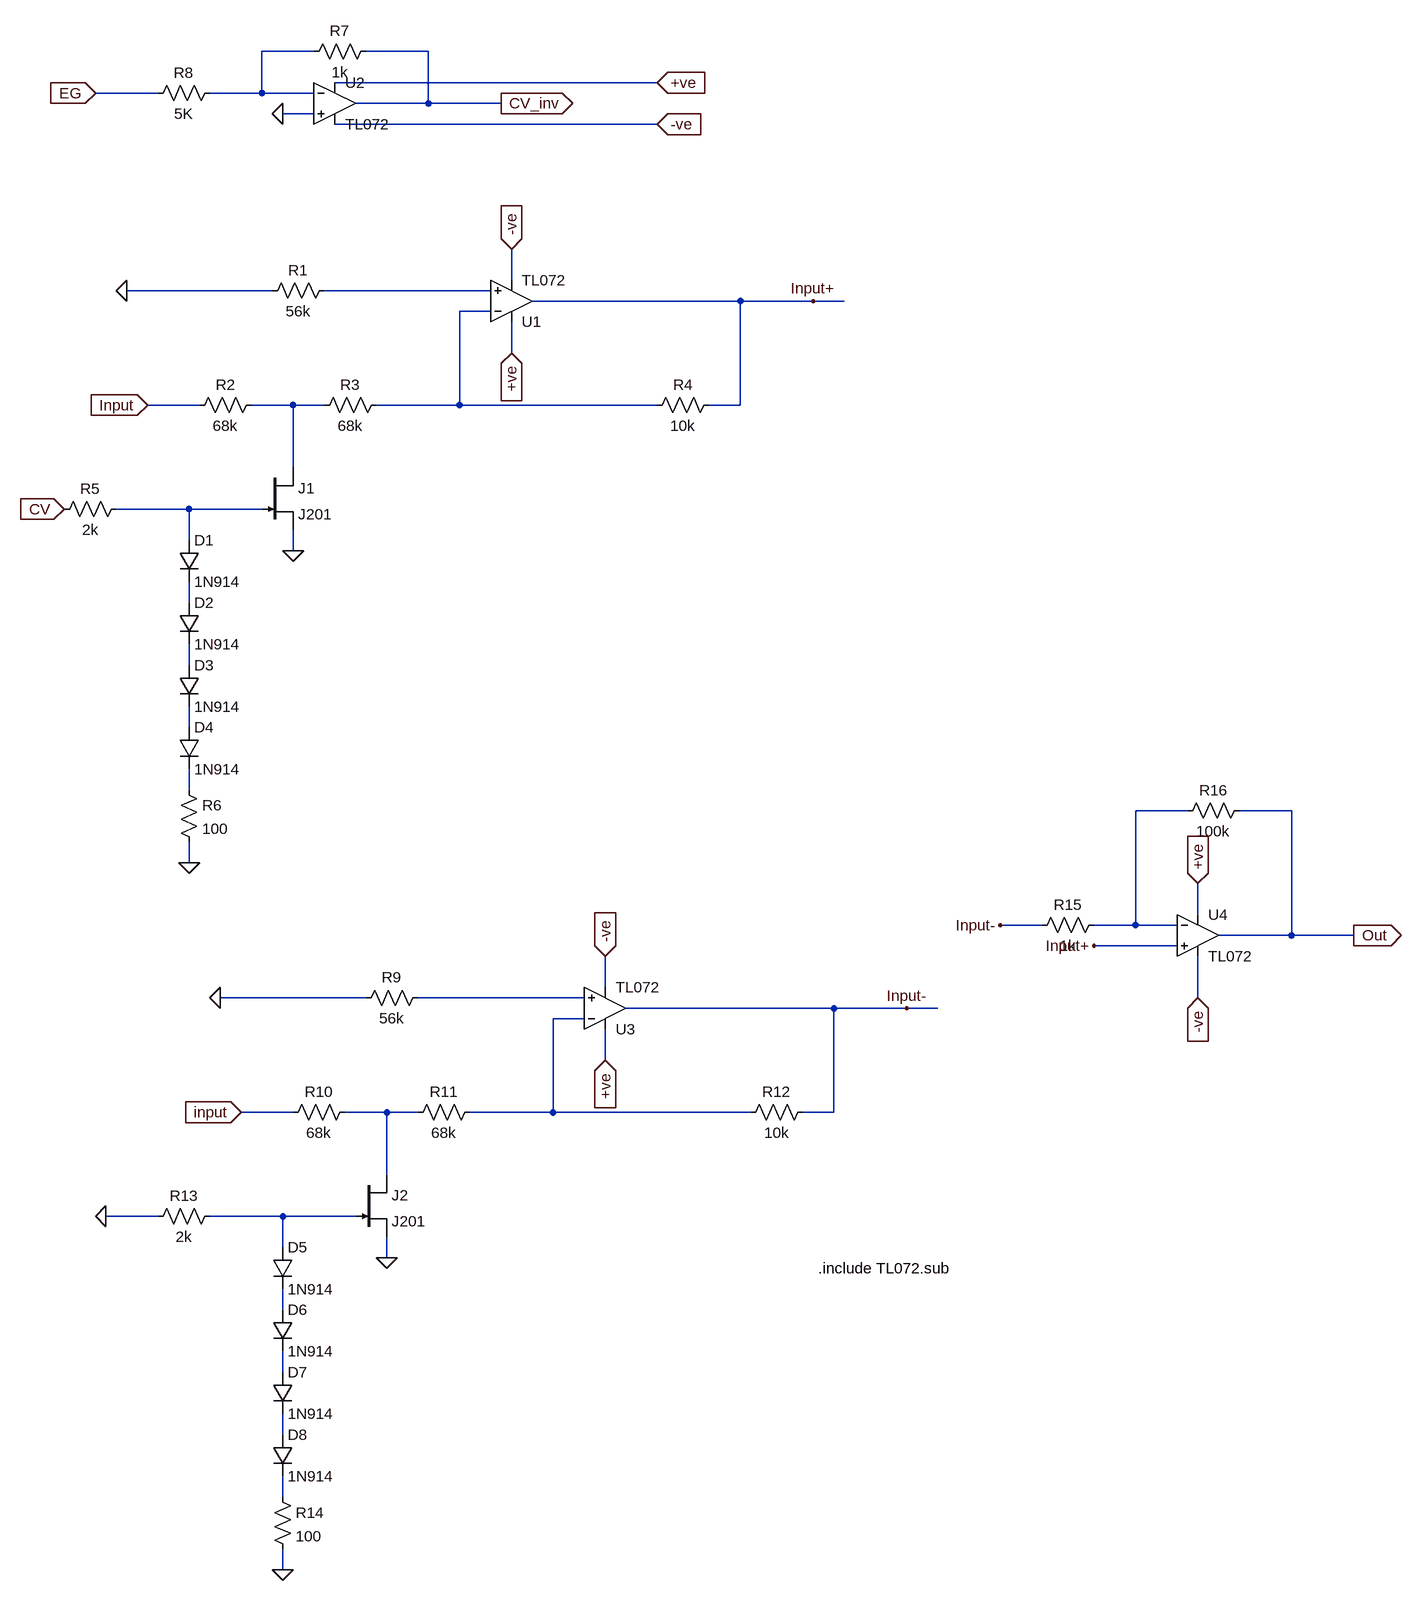
[diagram p0: schematic VCA_final.asc]
VCA_final.asc, the LTspice schematic file:
Version 4
SHEET 1 2292 680
WIRE -400 -2032 -480 -2032
WIRE -224 -2032 -320 -2032
WIRE 128 -1984 -368 -1984
WIRE -640 -1968 -736 -1968
WIRE -480 -1968 -480 -2032
WIRE -480 -1968 -560 -1968
WIRE -400 -1968 -480 -1968
WIRE -224 -1952 -224 -2032
WIRE -224 -1952 -336 -1952
WIRE -112 -1952 -224 -1952
WIRE -400 -1936 -448 -1936
WIRE 128 -1920 -368 -1920
WIRE -96 -1680 -96 -1728
WIRE -464 -1664 -688 -1664
WIRE -128 -1664 -384 -1664
WIRE 256 -1648 -64 -1648
WIRE 368 -1648 256 -1648
WIRE 416 -1648 368 -1648
WIRE -128 -1632 -176 -1632
WIRE -96 -1568 -96 -1616
WIRE -576 -1488 -656 -1488
WIRE -432 -1488 -496 -1488
WIRE -384 -1488 -432 -1488
WIRE -176 -1488 -176 -1632
WIRE -176 -1488 -304 -1488
WIRE 128 -1488 -176 -1488
WIRE 256 -1488 256 -1648
WIRE 256 -1488 208 -1488
WIRE -432 -1392 -432 -1488
WIRE -592 -1328 -704 -1328
WIRE -480 -1328 -592 -1328
WIRE -592 -1280 -592 -1328
WIRE -432 -1264 -432 -1296
WIRE -592 -1184 -592 -1216
WIRE -592 -1088 -592 -1120
WIRE -592 -992 -592 -1024
WIRE -592 -896 -592 -928
WIRE 944 -864 864 -864
WIRE 1104 -864 1024 -864
WIRE -592 -784 -592 -816
WIRE 960 -704 960 -752
WIRE 720 -688 656 -688
WIRE 864 -688 864 -864
WIRE 864 -688 800 -688
WIRE 928 -688 864 -688
WIRE 1104 -672 1104 -864
WIRE 1104 -672 992 -672
WIRE 1200 -672 1104 -672
WIRE 928 -656 800 -656
WIRE 48 -592 48 -640
WIRE -320 -576 -544 -576
WIRE 16 -576 -240 -576
WIRE 960 -576 960 -640
WIRE 400 -560 80 -560
WIRE 512 -560 400 -560
WIRE 560 -560 512 -560
WIRE 16 -544 -32 -544
WIRE 48 -480 48 -528
WIRE -432 -400 -512 -400
WIRE -288 -400 -352 -400
WIRE -240 -400 -288 -400
WIRE -32 -400 -32 -544
WIRE -32 -400 -160 -400
WIRE 272 -400 -32 -400
WIRE 400 -400 400 -560
WIRE 400 -400 352 -400
WIRE -288 -304 -288 -400
WIRE -640 -240 -720 -240
WIRE -448 -240 -560 -240
WIRE -336 -240 -448 -240
WIRE -448 -192 -448 -240
WIRE -288 -176 -288 -208
WIRE -448 -96 -448 -128
WIRE -448 0 -448 -32
WIRE -448 96 -448 64
WIRE -448 192 -448 160
WIRE -448 304 -448 272
FLAG -688 -1664 0
FLAG -432 -1264 0
FLAG -592 -784 0
FLAG -656 -1488 Input
IOPIN -656 -1488 In
FLAG -96 -1728 -ve
IOPIN -96 -1728 In
FLAG -96 -1568 +ve
IOPIN -96 -1568 In
FLAG -448 -1936 0
FLAG 128 -1984 +ve
IOPIN 128 -1984 In
FLAG 128 -1920 -ve
IOPIN 128 -1920 In
FLAG 368 -1648 Input+
FLAG -736 -1968 EG
IOPIN -736 -1968 In
FLAG -112 -1952 CV_inv
IOPIN -112 -1952 Out
FLAG -544 -576 0
FLAG -288 -176 0
FLAG -448 304 0
FLAG 48 -640 -ve
IOPIN 48 -640 In
FLAG 48 -480 +ve
IOPIN 48 -480 In
FLAG 512 -560 Input-
FLAG -720 -240 0
FLAG 960 -752 +ve
IOPIN 960 -752 In
FLAG 960 -576 -ve
IOPIN 960 -576 In
FLAG 800 -656 Input+
FLAG 656 -688 Input-
FLAG 1200 -672 Out
IOPIN 1200 -672 Out
FLAG -784 -1328 CV
IOPIN -784 -1328 In
FLAG -512 -400 input
IOPIN -512 -400 In
DATAFLAG -592 -1312 ""
DATAFLAG -448 -224 ""
SYMBOL res -368 -1680 R90
WINDOW 0 0 56 VBottom 2
WINDOW 3 32 56 VTop 2
SYMATTR InstName R1
SYMATTR Value 56k
SYMBOL res -480 -1504 R90
WINDOW 0 0 56 VBottom 2
WINDOW 3 32 56 VTop 2
SYMATTR InstName R2
SYMATTR Value 68k
SYMBOL res -288 -1504 R90
WINDOW 0 0 56 VBottom 2
WINDOW 3 32 56 VTop 2
SYMATTR InstName R3
SYMATTR Value 68k
SYMBOL res 224 -1504 R90
WINDOW 0 0 56 VBottom 2
WINDOW 3 32 56 VTop 2
SYMATTR InstName R4
SYMATTR Value 10k
SYMBOL res -688 -1344 R90
WINDOW 0 0 56 VBottom 2
WINDOW 3 32 56 VTop 2
SYMATTR InstName R5
SYMATTR Value 2k
SYMBOL Opamps\\opamp2 -96 -1584 M180
SYMATTR InstName U1
SYMATTR Value TL072
SYMBOL njf -480 -1392 R0
SYMATTR InstName J1
SYMATTR Value J201
SYMBOL diode -608 -1280 R0
SYMATTR InstName D1
SYMATTR Value 1N914
SYMBOL diode -608 -1184 R0
SYMATTR InstName D2
SYMATTR Value 1N914
SYMBOL diode -608 -1088 R0
SYMATTR InstName D3
SYMATTR Value 1N914
SYMBOL diode -608 -992 R0
SYMATTR InstName D4
SYMATTR Value 1N914
SYMBOL res -608 -912 R0
SYMATTR InstName R6
SYMATTR Value 100
SYMBOL Opamps\\opamp2 -368 -2016 R0
SYMATTR InstName U2
SYMATTR Value TL072
SYMBOL res -304 -2048 R90
WINDOW 0 0 56 VBottom 2
WINDOW 3 32 56 VTop 2
SYMATTR InstName R7
SYMATTR Value 1k
SYMBOL res -544 -1984 R90
WINDOW 0 0 56 VBottom 2
WINDOW 3 32 56 VTop 2
SYMATTR InstName R8
SYMATTR Value 5K
SYMBOL res -224 -592 R90
WINDOW 0 0 56 VBottom 2
WINDOW 3 32 56 VTop 2
SYMATTR InstName R9
SYMATTR Value 56k
SYMBOL res -336 -416 R90
WINDOW 0 0 56 VBottom 2
WINDOW 3 32 56 VTop 2
SYMATTR InstName R10
SYMATTR Value 68k
SYMBOL res -144 -416 R90
WINDOW 0 0 56 VBottom 2
WINDOW 3 32 56 VTop 2
SYMATTR InstName R11
SYMATTR Value 68k
SYMBOL res 368 -416 R90
WINDOW 0 0 56 VBottom 2
WINDOW 3 32 56 VTop 2
SYMATTR InstName R12
SYMATTR Value 10k
SYMBOL res -544 -256 R90
WINDOW 0 0 56 VBottom 2
WINDOW 3 32 56 VTop 2
SYMATTR InstName R13
SYMATTR Value 2k
SYMBOL Opamps\\opamp2 48 -496 M180
SYMATTR InstName U3
SYMATTR Value TL072
SYMBOL njf -336 -304 R0
SYMATTR InstName J2
SYMATTR Value J201
SYMBOL diode -464 -192 R0
SYMATTR InstName D5
SYMATTR Value 1N914
SYMBOL diode -464 -96 R0
SYMATTR InstName D6
SYMATTR Value 1N914
SYMBOL diode -464 0 R0
SYMATTR InstName D7
SYMATTR Value 1N914
SYMBOL diode -464 96 R0
SYMATTR InstName D8
SYMATTR Value 1N914
SYMBOL res -464 176 R0
SYMATTR InstName R14
SYMATTR Value 100
SYMBOL Opamps\\opamp2 960 -736 R0
SYMATTR InstName U4
SYMATTR Value TL072
SYMBOL res 816 -704 R90
WINDOW 0 0 56 VBottom 2
WINDOW 3 32 56 VTop 2
SYMATTR InstName R15
SYMATTR Value 1k
SYMBOL res 1040 -880 R90
WINDOW 0 0 56 VBottom 2
WINDOW 3 32 56 VTop 2
SYMATTR InstName R16
SYMATTR Value 100k
TEXT 376 -160 Left 2 !.include TL072.sub

The netlist it stands for:
* VCA_final.asc
R1 N002 0 56k
R2 N004 Input 68k
R3 N003 N004 68k
R4 Input+ N003 10k
R5 N005 CV 2k
XU1 N002 N003 +ve -ve Input+ TL072  ; pins In+ In- V+ V- OUT
J1 N004 N005 0 J201
D1 N005 N006 1N914
D2 N006 N007 1N914
D3 N007 N008 1N914
D4 N008 N009 1N914
R6 N009 0 100
XU2 0 N001 +ve -ve CV_inv TL072  ; pins In+ In- V+ V- OUT
R7 CV_inv N001 1k
R8 N001 EG 5K
R9 N011 0 56k
R10 N013 Input 68k
R11 N012 N013 68k
R12 Input- N012 10k
R13 N014 0 2k
XU3 N011 N012 +ve -ve Input- TL072  ; pins In+ In- V+ V- OUT
J2 N013 N014 0 J201
D5 N014 N015 1N914
D6 N015 N016 1N914
D7 N016 N017 1N914
D8 N017 N018 1N914
R14 N018 0 100
XU4 Input+ N010 +ve -ve Out TL072  ; pins In+ In- V+ V- OUT
R15 N010 Input- 1k
R16 Out N010 100k
.model D D
.lib standard.dio
.model NJF NJF
.model PJF PJF
.lib standard.jft
.include TL072.sub
.backanno
.end